# Altium project PCB_F2838_Node.PrjPcb (part 3 of 5)

## Sheet [5] F2838 ADC.SchDoc
size 431 x 279 mm; DocumentNumber: 6; SheetNumber: 6; SheetTotal: 9
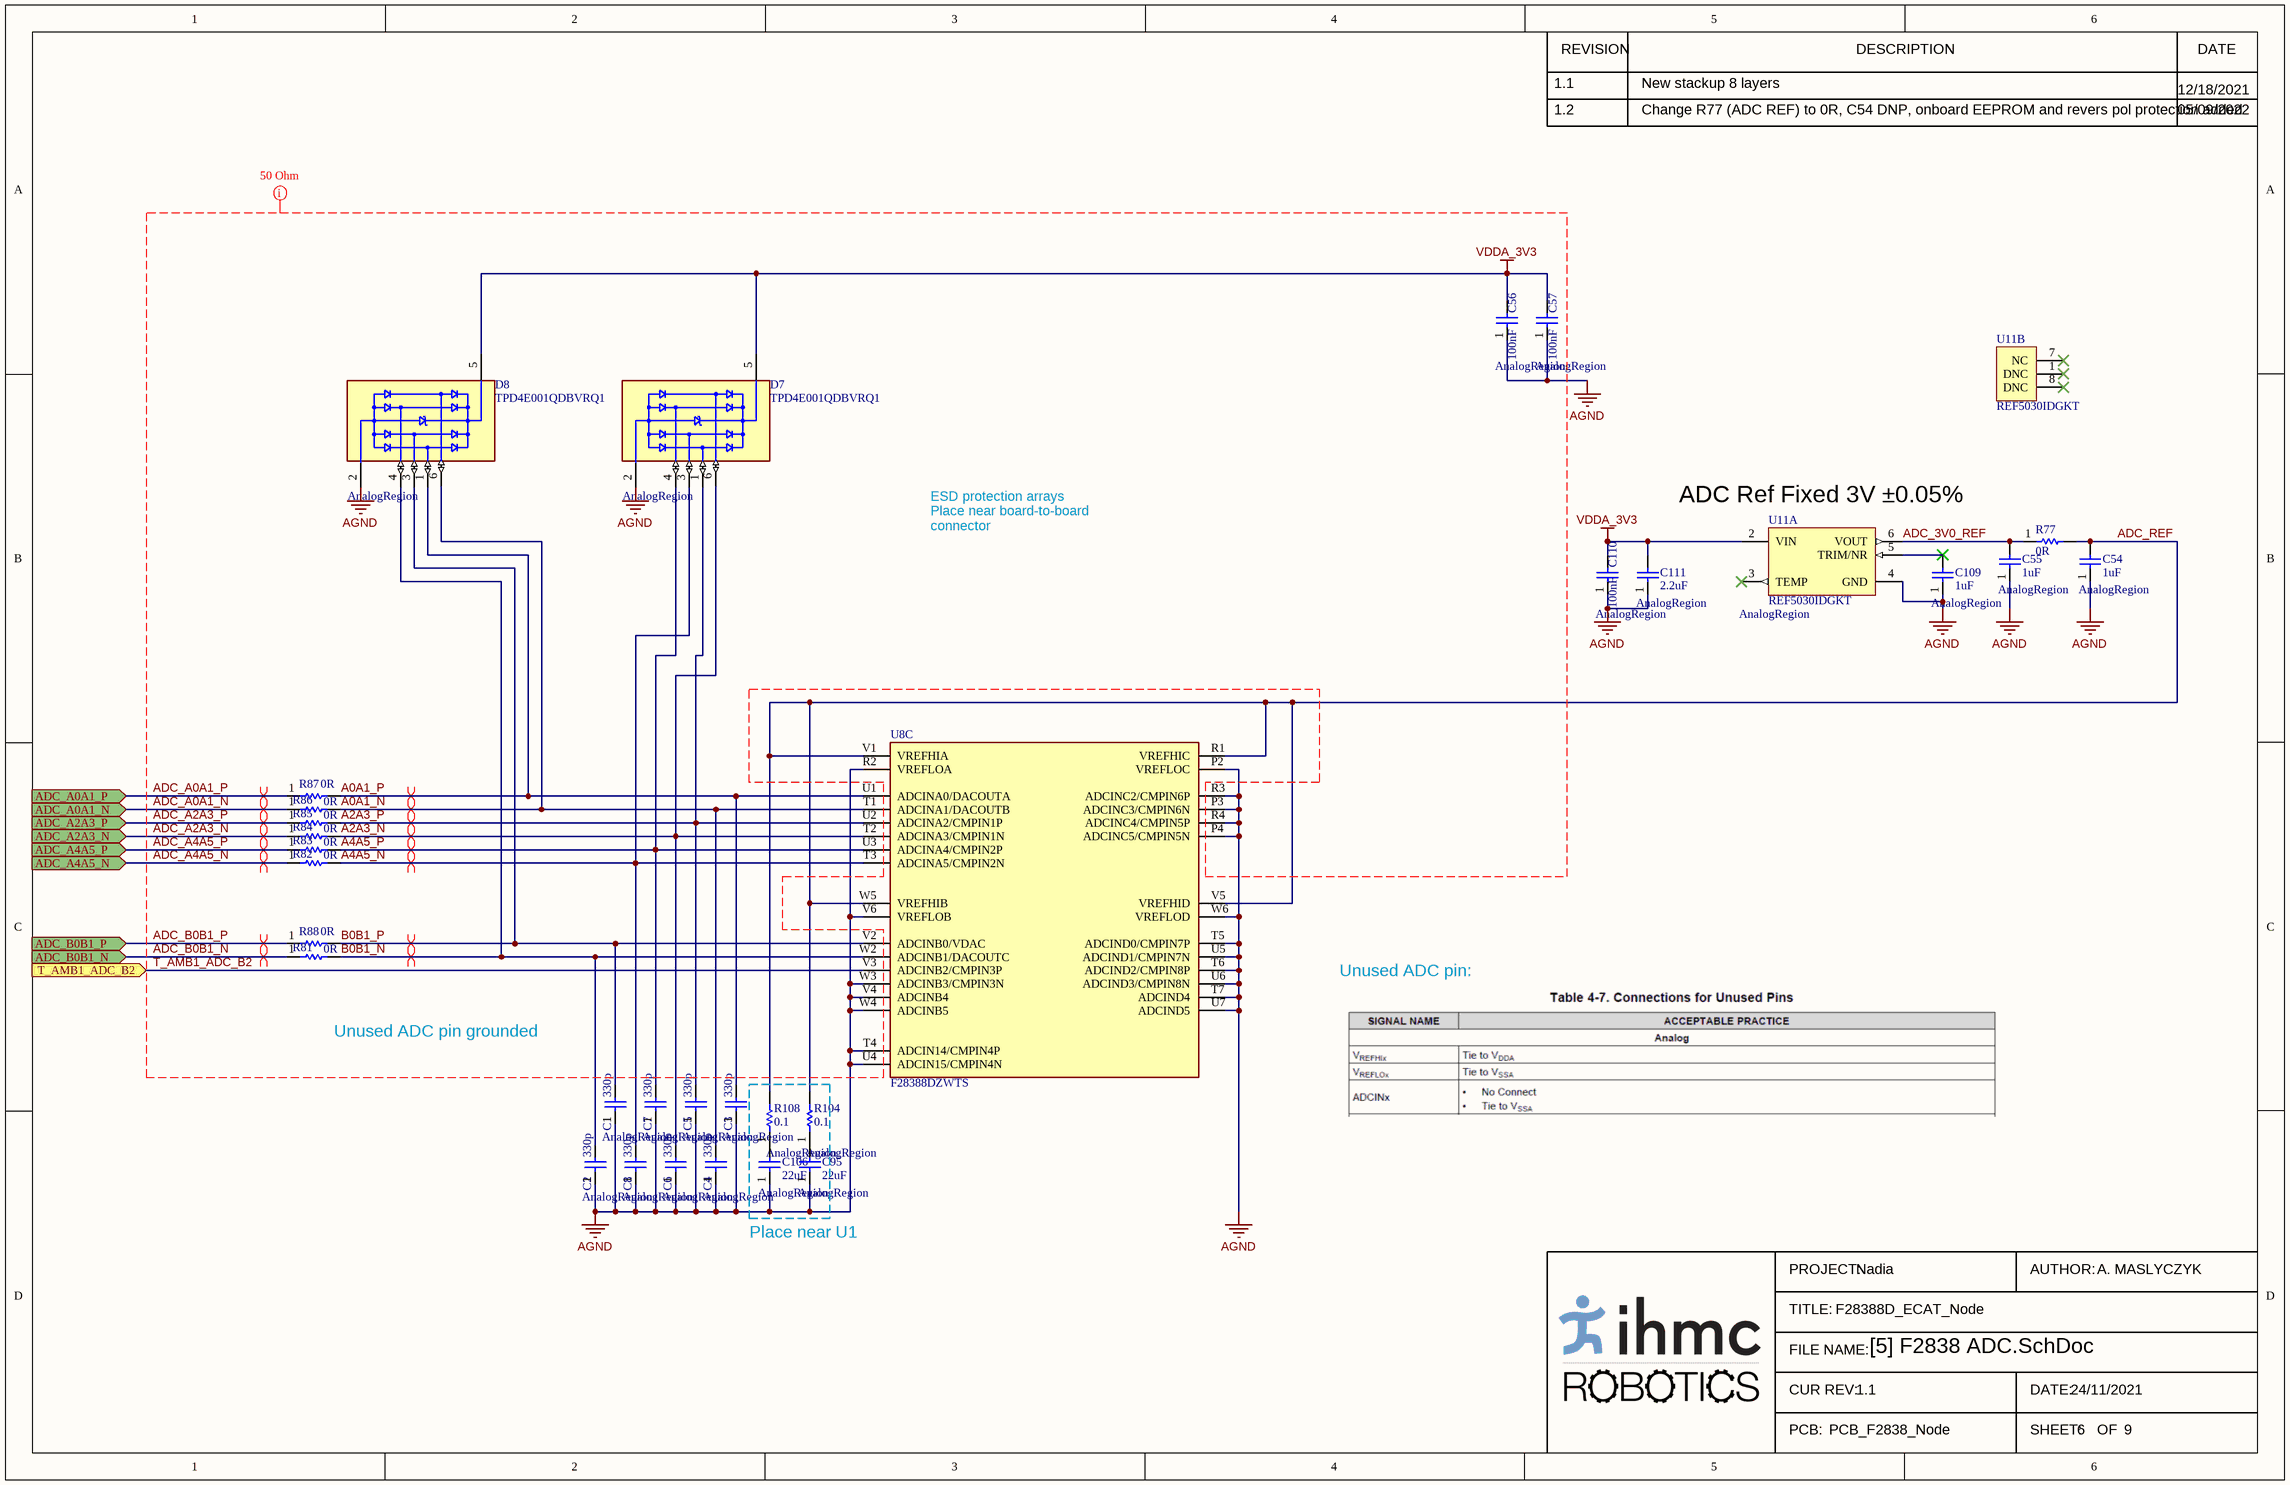
[diagram p5: [5] F2838 ADC.SchDoc]

### Parts
C1  value 330p  ClassName: AnalogRegion  [0402_C]  (hidden comment: CC0402JRNPO9BN331)
C2  value 330p  ClassName: AnalogRegion  [0402_C]  (hidden comment: CC0402JRNPO9BN331)
C3  value 330p  ClassName: AnalogRegion  [0402_C]  (hidden comment: CC0402JRNPO9BN331)
C4  value 330p  ClassName: AnalogRegion  [0402_C]  (hidden comment: CC0402JRNPO9BN331)
C5  value 330p  ClassName: AnalogRegion  [0402_C]  (hidden comment: CC0402JRNPO9BN331)
C6  value 330p  ClassName: AnalogRegion  [0402_C]  (hidden comment: CC0402JRNPO9BN331)
C7  value 330p  ClassName: AnalogRegion  [0402_C]  (hidden comment: CC0402JRNPO9BN331)
C8  value 330p  ClassName: AnalogRegion  [0402_C]  (hidden comment: CC0402JRNPO9BN331)
C54  value 1uF  ClassName: AnalogRegion  [CAPC1608X09N(0603)]  (hidden comment: C0603C105K3PACTU)
C55  value 1uF  ClassName: AnalogRegion  [CAPC1608X09N(0603)]  (hidden comment: C0603C105K3PACTU)
C56  value 100nF  ClassName: AnalogRegion  [CAPC1005X03N(0402)]  (hidden comment: GRM155R71C104JA88D)
C57  value 100nF  ClassName: AnalogRegion  [CAPC1005X03N(0402)]  (hidden comment: GRM155R71C104JA88D)
C95  value 22uF  ClassName: AnalogRegion  [CAPC1608X09N(0603)]  (hidden comment: C1608X5R1A226M080AC)
C106  value 22uF  ClassName: AnalogRegion  [CAPC1608X09N(0603)]  (hidden comment: C1608X5R1A226M080AC)
C109  value 1uF  ClassName: AnalogRegion  [CAPC1608X09N(0603)]  (hidden comment: C0603C105K3PACTU)
C110  value 100nF  ClassName: AnalogRegion  [CAPC1005X03N(0402)]  (hidden comment: GRM155R71C104JA88D)
C111  value 2.2uF  ClassName: AnalogRegion  [CAPC1608X09N(0603)]  (hidden comment: GRM188R61A225KE34D)
D7  TPD4E001QDBVRQ1  ClassName: AnalogRegion  [FP-DBV0006A-IPC_C]
D8  TPD4E001QDBVRQ1  ClassName: AnalogRegion  [FP-DBV0006A-IPC_C]
R77  value 0R  [RESC1608X09N(0603)]  (hidden comment: RC0603JR-070RL)
R81  value 0R  [0402]  (hidden comment: RCS04020000Z0ED)
R82  value 0R  [0402]  (hidden comment: RCS04020000Z0ED)
R83  value 0R  [0402]  (hidden comment: RCS04020000Z0ED)
R84  value 0R  [0402]  (hidden comment: RCS04020000Z0ED)
R85  value 0R  [0402]  (hidden comment: RCS04020000Z0ED)
R86  value 0R  [0402]  (hidden comment: RCS04020000Z0ED)
R87  value 0R  [0402]  (hidden comment: RCS04020000Z0ED)
R88  value 0R  [0402]  (hidden comment: RCS04020000Z0ED)
R104  value 0.1  ClassName: AnalogRegion  [0402]  (hidden comment: ERJ2BWFR100X_RES)
R108  value 0.1  ClassName: AnalogRegion  [0402]  (hidden comment: ERJ2BWFR100X_RES)
U8  F28388DZWTS  [FP-ZWT0337A-IPC_B - ESNACK]  (part C of 8)
U11  REF5030IDGKT  ClassName: AnalogRegion  [DGK0008A_L]  (parts A,B of 2)

### Ports
ADC_A0A1_N (in), ADC_A0A1_P (in), ADC_A2A3_N (in), ADC_A2A3_P (in), ADC_A4A5_N (in), ADC_A4A5_P (in), ADC_B0B1_N (in), ADC_B0B1_P (in), T_AMB1_ADC_B2 (in)

### Nets
AGND: C1.1 C2.1 C3.1 C4.1 C5.1 C6.1 C7.1 C8.1 C54.1 C55.1 C56.1 C57.1 C95.1 C106.1 C109.1 C110.1 C111.1 D7.2(GND) D8.2(GND) U8.P2(VREFLOC) U8.P3(ADCINC3/CMPIN6N) U8.P4(ADCINC5/CMPIN5N) U8.R2(VREFLOA) U8.R3(ADCINC2/CMPIN6P) U8.R4(ADCINC4/CMPIN5P) U8.T4(ADCIN14/CMPIN4P) U8.T5(ADCIND0/CMPIN7P) U8.T6(ADCIND2/CMPIN8P) U8.T7(ADCIND4) U8.U4(ADCIN15/CMPIN4N) U8.U5(ADCIND1/CMPIN7N) U8.U6(ADCIND3/CMPIN8N) U8.U7(ADCIND5) U8.V4(ADCINB4) U8.V6(VREFLOB) U8.W3(ADCINB3/CMPIN3N) U8.W4(ADCINB5) U8.W6(VREFLOD) U11.4(GND)
VDDA_3V3: C56.2 C57.2 C110.2 C111.2 D7.5(VCC) D8.5(VCC) U11.2(VIN)
A0A1_N: C4.2 D8.6(IO4) R86.2 U8.T1(ADCINA1/DACOUTB)
A0A1_P: C3.2 D8.1(IO1) R87.2 U8.U1(ADCINA0/DACOUTA)
A2A3_N: C6.2 D7.6(IO4) R84.2 U8.T2(ADCINA3/CMPIN1N)
A2A3_P: C5.2 D7.1(IO1) R85.2 U8.U2(ADCINA2/CMPIN1P)
A4A5_N: C8.2 D7.3(IO2) R82.2 U8.T3(ADCINA5/CMPIN2N)
A4A5_P: C7.2 D7.4(IO3) R83.2 U8.U3(ADCINA4/CMPIN2P)
ADC_3V0_REF: C55.2 R77.1 U11.6(VOUT)
ADC_A0A1_N: R86.1 ; port ADC_A0A1_N
ADC_A0A1_P: R87.1 ; port ADC_A0A1_P
ADC_A2A3_N: R84.1 ; port ADC_A2A3_N
ADC_A2A3_P: R85.1 ; port ADC_A2A3_P
ADC_A4A5_N: R82.1 ; port ADC_A4A5_N
ADC_A4A5_P: R83.1 ; port ADC_A4A5_P
ADC_B0B1_N: R81.1 ; port ADC_B0B1_N
ADC_B0B1_P: R88.1 ; port ADC_B0B1_P
ADC_REF: C54.2 R77.2 R104.2 R108.2 U8.R1(VREFHIC) U8.V1(VREFHIA) U8.V5(VREFHID) U8.W5(VREFHIB)
B0B1_N: C2.2 D8.4(IO3) R81.2 U8.W2(ADCINB1/DACOUTC)
B0B1_P: C1.2 D8.3(IO2) R88.2 U8.V2(ADCINB0/VDAC)
T_AMB1_ADC_B2: U8.V3(ADCINB2/CMPIN3P) ; port T_AMB1_ADC_B2
NetC95_2: C95.2 R104.1
NetC106_2: C106.2 R108.1
NetC109_2: C109.2 U11.5(TRIM/NR)

Not connected (* = marked no-connect by the designer): U11 1(DNC)* 3(TEMP)* 7(NC)* 8(DNC)*

### Layout directives
differential pair: A0A1_N, A0A1_P, A2A3_N, A2A3_P, A4A5_N, A4A5_P, ADC_A0A1_N, ADC_A0A1_P, ADC_A2A3_N, ADC_A2A3_P, ADC_A4A5_N, ADC_A4A5_P, ADC_B0B1_N, ADC_B0B1_P, B0B1_N, B0B1_P
50 Ohm Impedance: Undefined: A0A1_N, A0A1_P, A2A3_N, A2A3_P, A4A5_N, A4A5_P, ADC_A0A1_N, ADC_A0A1_P, ADC_A2A3_N, ADC_A2A3_P, ADC_A4A5_N, ADC_A4A5_P, ADC_B0B1_N, ADC_B0B1_P, AGND, B0B1_N, B0B1_P, T_AMB1_ADC_B2, VDDA_3V3

### Notes on the sheet
- (near U11) ADC Ref Fixed 3V ±0.05%
- ESD protection arrays
  Place near board-to-board connector
- Unused ADC pin:
- Unused ADC pin grounded
- Place near U1
- REVISION
- DESCRIPTION
- DATE
- PROJECT:
- AUTHOR:
- TITLE:
- FILE NAME:
- CUR REV:
- PCB:
- SHEET:
- DATE:
- OF

### Library data of the parts
C1-C8 = 330pF_5%_C0G_50V_CC0402JRNPO9BN331_CAP: 0402 330 pF 50 V ±5 % Tolerance NP0 SMT Multilayer Ceramic Capacitor; Manufacturer: Yageo; Capacitance: 330pF; Tolerance: 5%; Voltage Rating (DC): 50V; Dielectric: C0G; Supplier 1: Digi-Key; Manufacturer Part Number: CC0402JRNPO9BN331; RoHS: Yes; Category: Ceramic Capacitors; Stock 1: 93737; Pricing 1: 1=0.10000, 10=0.05700, 50=0.03080, 100=0.02520, 500=0.01800, 1000=0.01414, 2500=0.01285, 5000=0.01182 (USD); Mount: Surface Mount; Case/Package: 0402; Case Code (Metric): 1005; Case Code (Imperial): 0402; Min Operating Temperature: -55°C; Max Operating Temperature: 125°C; Packaging: Tape and Reel; Voltage Rating: 50V; Termination: SMD/SMT; Series: CC; Length: 1mm; Width: 0.02inch; Thickness: 0.022inch; Depth: 0.5mm; Radiation Hardening: No; Lead Free: Lead Free; RoHS Compliant: Yes; ComponentLink1URL: https://datasheet.ciiva.com/13263/upy-gp-np0-16v-to-50v-8-3714-13263429.pdf?src-supplier=Mouser; ComponentLink1Description: https://datasheet.ciiva.com/13263/upy-gp-np0-16v-to-50v-8-3714-13263429.pdf?src-supplier=Mouser; ComponentLink2URL: https://datasheet.ciiva.com/26829/getdatasheetpartid-403454-26829291.pdf?src-supplier=Verical; ComponentLink2Description: https://datasheet.ciiva.com/26829/getdatasheetpartid-403454-26829291.pdf?src-supplier=Verical; Supplier Part Number 1: 311-1667-1-ND; Weight: 2.3E-05oz; Resistor Type: Ceramic
C54 C55 C109 = 1uF_25VDC_0603_Cap: MLCC - SMD/SMT 25volts 1uF X5R 10%; Voltage: 25VDC; Drawn By: TC; MPN: C0603C105K3PACTU; Tolerance: 10%; Supplier 1: Mouser; Supplier Part Number 1: 80-C0603C105K3PAC
C56 C57 C110 = 100nF_16V_0402_CAP: CAP CER 0.1UF 16V X7R 0402; Tolerance: 5%; MPN: GRM155R71C104JA88D; Voltage Rating: 16V; Temp Coeff: X7R; Size/Package: 0402
C95 C106 = 22uF_10V_0603_CAP: CAP CER 22UF 10V X5R 0603; Tolerance: 20%; MPN: C1608X5R1A226M080AC; Voltage: 10V; Temp Cofficient: X5R; Package: 0603; Supplier 1: Digikey; Supplier Part Number 1: 445-9077-6-ND
C111 = 2.2uF_10V_0603_CAP: CAP CER 2.2UF 10V X5R 0603; Tolerance: 10%; MPN: GRM188R61A225KE34D; Voltage Rating: 10V; Temp Cofficient: X5R; Size: 0603; Supplier 1: Digikey; Supplier Part Number 1: 490-1545-1-ND
D7 D8 = TVS_16V_4_TPD4E001QDBVRQ1: TVS DIODE 5.5V 16V SOT23-6; Power Line Protection: Yes; Breakdown Voltage: 11V; Peak Pulse Power: 100W; Number of Channels: 4; Peak Pulse Current: 5.5A; Current Rating: 1nA; Forward Voltage: 950mV; Direction: Unidirectional; Capacitance: 1.5pF; Leakage Current: 200nA; Interface: LVDS; Operating Supply Voltage: 5.5V; Number of Pins: 6; Lead Free: Lead Free; Max Operating Temperature: 125°C; Length: 3.05mm; RoHS Compliant: Yes; Reverse Standoff Voltage: 5.5V; Depth: 1.75mm; Mount: Surface Mount; Termination: SMD/SMT; Radiation Hardening: No; Min Breakdown Voltage: 11V; Max Power Dissipation: 100W; Clamping Voltage: 16V; Case/Package: SOT-23-6; Min Operating Temperature: -40°C; Packaging: Tape and Reel; Package Quantity: 3000; Working Voltage: 5.5V; Number of Bidirectional Channels: 4; Polarity: Unidirectional
R77 = 0R_1/10W_0603_RES: RES SMD 0 OHM JUMPER 1/10W 0603; MPN: RC0603JR-070RL; Supplier 1: Digi-Key; Supplier Part Number 1: 311-0.0GRDKR-ND; Tolerance: Jumper; Power: 1/10W; Package/Case: 0603
R81-R88 = 0R_1/5W_0402_RCS04020000Z0ED_RES: VISHAY - RCS04020000Z0ED - SMD Chip Resistor, 0402 [1005 Metric], 0 ohm, RCS Series, 50 V, Thick Film, 200 mW; Manufacturer: Vishay Dale; Resistance: 0mR; Max Power Dissipation: 200mW; Supplier 1: Digi-Key; Manufacturer Part Number: RCS04020000Z0ED; RoHS: Yes; Category: Chip SMD Resistors; Stock 1: 18214; Pricing 1: 1=0.10000, 10=0.08300, 25=0.05760, 50=0.04480, 100=0.03200, 250=0.02496, 500=0.01984, 1000=0.01408, 5000=0.01088 (USD); Case/Package: 0402; Case Code (Metric): 1005; Case Code (Imperial): 0402; Min Operating Temperature: -55°C; Max Operating Temperature: 155°C; Packaging: Tape and Reel; Resistor Type: Thick Film; Number of Terminations: 2; Features: Automotive AEC-Q200; Length: 0.039inch; Width: 0.02inch; Height: 0.016inch; RoHS Compliant: Yes; ComponentLink1URL: http://www.farnell.com/datasheets/2618474.pdf?src-supplier=Farnell; ComponentLink1Description: http://www.farnell.com/datasheets/2618474.pdf?src-supplier=Farnell; ComponentLink2URL: http://www.vishay.com/docs/20065/rcse3.pdf?src-supplier=Digi-Key; ComponentLink2Description: http://www.vishay.com/docs/20065/rcse3.pdf?src-supplier=Digi-Key; ComponentLink3URL: http://www.farnell.com/datasheets/2618474.pdf?src-supplier=Element14; ComponentLink3Description: http://www.farnell.com/datasheets/2618474.pdf?src-supplier=Element14; ComponentLink4URL: http://www.farnell.com/datasheets/2618474.pdf?src-supplier=Newark; ComponentLink4Description: http://www.farnell.com/datasheets/2618474.pdf?src-supplier=Newark; Supplier Part Number 1: 541-2877-1-ND
R104 R108 = 100mR_0402_ERJ2BWFR100X_RES: RES 0.1 OHM 1% 1/4W 0402; Manufacturer: Panasonic; Manufacturer Part Number: ERJ-2BWFR100X; Resistance: 100mR; Power Rating: 250mW; Temperature Coefficient: 300ppm/°C; Supplier 1: Digi-Key; RoHS: Yes; Category: Chip SMD Resistors; Pricing 1: 1=0,39000, 10=0,29700, 25=0,22560, 50=0,16760, 100=0,12470, 250=0,10536, 500=0,09030, 1000=0,06880, 5000=0,05848 (USD); Mount: Surface Mount; Case/Package: 0402; Case Code (Metric): 1005; Case Code (Imperial): 0402; Contact Plating: Tin; Min Operating Temperature: -55°C; Max Operating Temperature: 155°C; Packaging: Tape and Reel; Resistor Type: Thick Film; Number of Terminations: 2; Tolerance: 1%; Max Power Dissipation: 250mW; Termination: Wraparound; Features: Automotive AEC-Q200; Length: 0.039inch; Width: 0.02inch; Height: 0.016inch; RoHS Compliant: Yes; ComponentLink1URL: http://www.mouser.com/ds/2/315/AOA0000C295-1109214.pdf?src-supplier=Mouser; ComponentLink1Description: http://www.mouser.com/ds/2/315/AOA0000C295-1109214.pdf?src-supplier=Mouser; ComponentLink2URL: https://industrial.panasonic.com/cdbs/www-data/pdf/RDN0000/AOA0000C313.pdf?src-supplier=Digi-Key; ComponentLink2Description: https://industrial.panasonic.com/cdbs/www-data/pdf/RDN0000/AOA0000C313.pdf?src-supplier=Digi-Key; ComponentLink3URL: http://industrial.panasonic.com/lecs/www-data/pdf/AOA0000/AOA0000CE3.pdf?src-supplier=Avnet+Asia; ComponentLink3Description: http://industrial.panasonic.com/lecs/www-data/pdf/AOA0000/AOA0000CE3.pdf?src-supplier=Avnet+Asia; Supplier Part Number 1: P17368DKR-ND
U8 = TMS320F28388D_32bit_uC: 32-bit MCU with connectivity manager, 2x C28x+CLA CPU, 1.5 MB flash, FPU64, CLB, Ethernet, EtherCAT 337-NFBGA -40 to +125; Manufacturer: Texas instruments; Standoff Height: 0.35mm; Number Of Usb Channels: 1; Max Junction Temp: +125°C; Data Bus Width: 32bits; Number Of I/Os: 169; Number Of A/D Converters: 4; Number Of Cores: 2; Number Of Uart Channels: 5; Min Supply Voltage: 1.14V; Memory Size: 1.5MBytes; Interface: I2C,SPI,UART,EBI/EMI,CAN,USB,SCI,IrDA,Ethernet,I2S,SMBus,LVCMOS,Other; Number Of Timers/Counters: 6; Number Of Adc Channels: 24; Ram Size: 312KBytes; Max Supply Voltage: 3.47V; Frequency: 200MHz; Core Architecture: C28x; Number Of Pwm Channels: 32; Number Of I2C Channels: 3; Device Class L1: Integrated Circuits (ICs); Category: IC; ComponentLink2URL: http://www.ti.com/lit/ds/symlink/tms320f28388s.pdf; Number Of Ethernet Channels: 1; Memory Type: FLASH; Device Class L2: Embedded Processors and Controllers; ComponentLink2Description: Datasheet; Package: ZWT0337A; Temperature Range Low: -40°C; RoHS: TRUE; Lead Free: Yes; Device Class L3: Microcontrollers; Automotive: No; Height: 1.4mm; Ambient Temperature Range Low: -40°C; Ipc Land Pattern Name: BGA361N80P19X19_1600X1600X140; Number Of Spi Channels: 4; Ambient Temperature Range High: +125°C; Octopart: https://octopart.com/f28388dzwts-texas+instruments-102550657; Manufacturer Part Number: F28388DZWTS; Temperature Range High: +125°C; Temperature: -40°C to +125°C
U11 = REF5030IDGKT_REF_PREC: IC VREF SERIES 3V 8VSSOP; Manufacturer: Texas Instruments; Iq(Max)(uA): 1000; SubFamily: Series Voltage Reference; Iout/Iz(Max)(mA): 10; VI(Min)(V): 3.2; Initial Accuracy @ 25/deg C(%): 0.05; VI(Max)(V): 18; Temp Coeff(Max)(ppm/ degree C): 3; Rating: Catalog; Eco-Plan: Green (RoHS & no Sb/Br); Tolerance: 0.05%; Max Input Voltage: 18V; Min Input Voltage: 3.2V; Nominal Supply Current: 800uA; Max Output Current: 10mA; Operating Supply Current: 1.2mA; Temperature Coefficient: 3ppm/°C; Output Type: Fixed; ComponentLink2Description: Datasheet; Mounting Technology: Surface Mount; ComponentLink2URL: http://www.ti.com/general/docs/lit/getliterature.tsp?genericPartNumber=REF5030&fileType=pdf; PartNumber: REF5030IDGKT; ComponentLink3Description: Package Specification; PackageVersion: 4073329/E; DatasheetVersion: SBOS410E; Code_JEDEC: MO-187; ComponentLink1URL: http://www.ti.com/; PackageReference: DGK0008A; ComponentLink3URL: http://www.ti.com/litv/pdf/mpds028d; PackageDescription: 8-Pin Thin Small Outline Package 3 x 3 mm Body ,0.65 mm Pitch; ComponentLink1Description: Manufacturer URL; VO(V): 3; Supplier 1: Digi-Key; Manufacturer Part Number: REF5030IDGKT; RoHS: Yes; Category: Voltage References; Stock 1: 203; Pricing 1: 1=7,70000, 10=6,95800, 25=6,63400, 100=5,76040 (USD); Case/Package: VSSOP; Number of Pins: 8; Weight: 0.00067oz; Min Operating Temperature: -40°C; Max Operating Temperature: 125°C; Package Quantity: 1; Packaging: Tape and Reel; Output Voltage: 3V; Min Output Voltage: 3V; Output Current: 10mA; Max Output Voltage: 3V; Quiescent Current: 800uA; Reference Type: Series; Series: -; Supply Current: 800uA; Radiation Hardening: No; Lead Free: Lead Free; RoHS Compliant: Yes; ComponentLink4URL: https://datasheet.ciiva.com/14197/ref5050-14197436.pdf?src-supplier=Avnet; ComponentLink4Description: https://datasheet.ciiva.com/14197/ref5050-14197436.pdf?src-supplier=Avnet; ComponentLink5URL: https://datasheet.ciiva.com/2007/ref5020-2007543.pdf?src-supplier=Digi-Key; ComponentLink5Description: https://datasheet.ciiva.com/2007/ref5020-2007543.pdf?src-supplier=Digi-Key; ComponentLink6URL: https://datasheet.ciiva.com/2007/ref5020-2007544.pdf?src-supplier=Digi-Key; ComponentLink6Description: https://datasheet.ciiva.com/2007/ref5020-2007544.pdf?src-supplier=Digi-Key; ComponentLink7URL: https://datasheet.ciiva.com/2007/ref5020-2007545.pdf?src-supplier=Digi-Key; ComponentLink7Description: https://datasheet.ciiva.com/2007/ref5020-2007545.pdf?src-supplier=Digi-Key; ComponentLink8URL: https://datasheet.ciiva.com/3235/ref5050-3235580.pdf?src-supplier=Avnet; ComponentLink8Description: https://datasheet.ciiva.com/3235/ref5050-3235580.pdf?src-supplier=Avnet; Supplier Part Number 1: 296-24501-1-ND